# Altium schematic sheet debug_interface.SchDoc: Debug interface
size A4; SheetNumber: 3; SheetTotal: 11
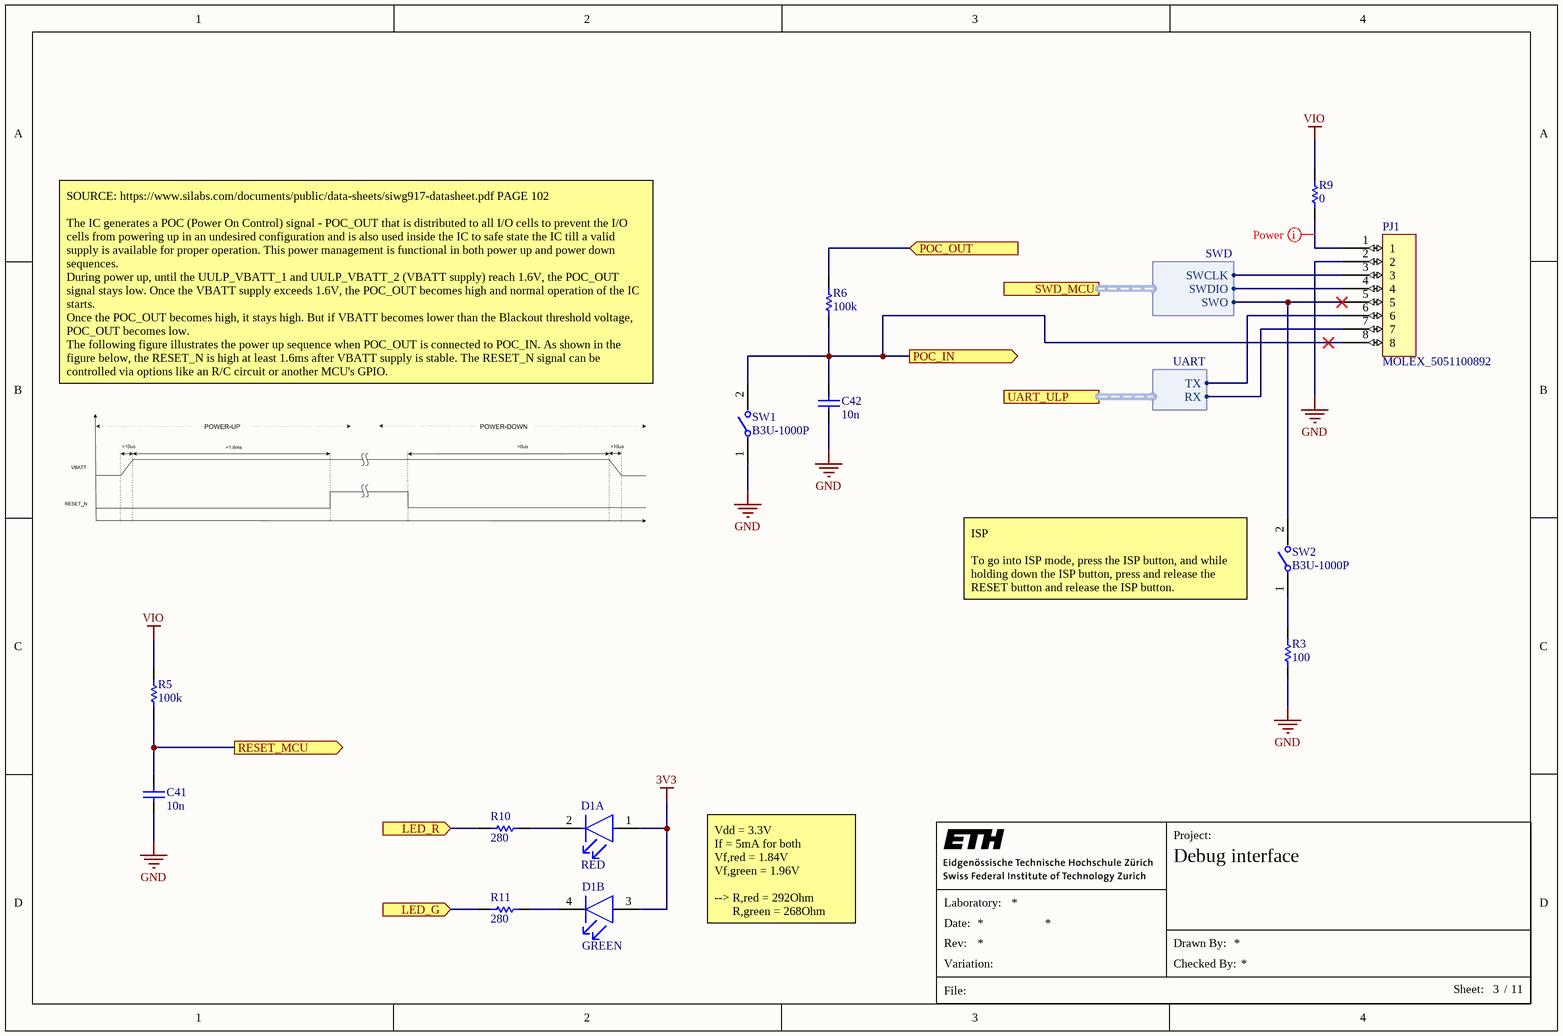
[diagram p0: debug_interface.SchDoc]

## Parts
C41  10n  [CAPC1005X55X25LL05T10]
C42  10n  [CAPC1005X55X25LL05T10]
D1  RED  [FP-APTB1615SURKCGKC-F01-MFG]  (parts A,B of 2)
PJ1  MOLEX_5051100892  [MOLEX_5051100892]
R3  100  [RESC1005X40X25ML05T10]
R5  100k  [RESC1005X40X25NL05T10]
R6  100k  [RESC1005X40X25NL05T10]
R9  value 0  [RESC1005X40X25ML05T10]  (hidden comment: Resistor 0R 0402 63 mW)
R10  280  [RESC1005X40X25NL05T10]
R11  280  [RESC1005X40X25NL05T10]
SW1  B3U-1000P  [FP-B3U-1000P-MFG]
SW2  B3U-1000P  [FP-B3U-1000P-MFG]

## Ports
LED_G (in, see main[3B], io_a[3A], power_io[6B]), LED_R (in, see main[3A], io_a[3A], power_io[6B]), POC_IN (out, see main[3A], power_core[1C], power_io[2B]), POC_OUT (in, see main[3A], power_core[1C], power_io[2B]), RESET_MCU (out, see main[3A], power_core[1C], power_io[2B]), SWD_MCU (harness SWD, see main[3A], io_b[4C], power_io[6C]), UART_ULP (harness UART, see main[3A], io_b[4C], power_io[6C])

## Harnesses
SWD: SWCLK, SWDIO, SWO
UART: RX, TX

## Nets
3V3: D1.1(RED_A) D1.3(GREEN_A)
GND: C41.2 C42.2 PJ1.2 R3.1 SW1.1
VIO: R5.2 R9.2
LED_G: R11.1 ; port LED_G
LED_R: R10.1 ; port LED_R
POC_IN: C42.1 PJ1.8 R6.1 SW1.2 ; port POC_IN
POC_OUT: R6.2 ; port POC_OUT
RESET_MCU: C41.1 R5.1 ; port RESET_MCU
NetD1_2: D1.2(RED_C) R10.2
NetD1_4: D1.4(GREEN_C) R11.2
NetPJ1_1: PJ1.1 R9.1
NetPJ1_3: PJ1.3 ; port SWD_MCU.SWCLK
NetPJ1_4: PJ1.4 ; port SWD_MCU.SWDIO
NetPJ1_5: PJ1.5 SW2.2 ; port SWD_MCU.SWO
NetPJ1_6: PJ1.6 ; port UART_ULP.TX
NetPJ1_7: PJ1.7 ; port UART_ULP.RX
NetR3_2: R3.2 SW2.1

## Layout directives
net class Power: NetPJ1_1

## Notes on the sheet
- SOURCE: https://www.silabs.com/documents/public/data-sheets/siwg917-datasheet.pdf PAGE 102
  The IC generates a POC (Power On Control) signal - POC_OUT that is distributed to all I/O cells to prevent the I/O cells from powering up in an undesired configuration and is also used inside the IC to safe state the IC till a valid supply is available for proper operation. This power management is functional in both power up and power down sequences.
  During power up, until the UULP_VBATT_1 and UULP_VBATT_2 (VBATT supply) reach 1.6V, the POC_OUT signal stays low. Once the VBATT supply exceeds 1.6V, the POC_OUT becomes high and normal operation of the IC starts.
  Once the POC_OUT becomes high, it stays high. But if VBATT becomes lower than the Blackout threshold voltage, POC_OUT becomes low.
  The following figure illustrates the power up sequence when POC_OUT is connected to POC_IN. As shown in the figure below, the RESET_N is high at least 1.6ms after VBATT supply is stable. The RESET_N signal can be controlled via options like an R/C circuit or another MCU's GPIO.
- ISP
  To go into ISP mode, press the ISP button, and while holding down the ISP button, press and release the RESET button and release the ISP button.
- Vdd = 3.3V
  If = 5mA for both
  Vf,red = 1.84V
  Vf,green = 1.96V
  --> R,red = 292Ohm
  R,green = 268Ohm
- Project:
- Laboratory:
- Date:
- File:
- Rev:
- Variation:
- Drawn By:
- Checked By:
- Sheet:
- /

## Library data of the parts
C41 C42 = CMP-1034-01880-2: Manufacturer: Murata; Part Number: GRM155R71E103KA01D
D1 = CMP-44529-000005-1: LED GREEN/RED CLEAR CHIP SMD; Manufacturer: Kingbright; Manufacturer Part Number: APTB1615SURKCGKC-F01; Reverse Voltage: 5V; Viewing Angle: 150°; Max Junction Temp: +115°C; Led Orientation: Top View; Wavelength: 630/570nm; Colour: Red, Green; Forward Voltage: 1.95/2.1V; Peak Emmision Wavelength: 645/574nm; Power Dissipation: 75mW; Forward Current: 20mA; Luminous Intensity: 200/50mcd; Temperature Range High: +85°C; Temperature: -40°C to +85°C; Digikey Description: LED GREEN/RED CLEAR CHIP SMD; RoHS: TRUE; Automotive: No; Octopart: https://octopart.com/aptb1615surkcgkc-f01-kingbright-5355651; Temperature Range Low: -40°C; Device Class L3: unset; ComponentLink2Description: Datasheet; Device Class L1: Optoelectronics; Height: 0.9mm; ComponentLink2URL: http://www.kingbrightusa.com/images/catalog/SPEC/APTB1615SURKCGKC-F01.pdf; Category: Diode; Package: APTB1615SURKCGKC-F01; Device Class L2: LEDs; Lead Free: Yes
R3 = CMP-2002-07344-1: Part Number: RC0402FR-07100RL; Manufacturer: Yageo / Phycomp
R5 R6 = CMP-2002-07343-1: Part Number: RC0402FR-07100KL; Manufacturer: Yageo / Phycomp
R9 = CMP-009-00004-5: Chip Resistor, 0 Ohm, 0.063 W, -55 to 155 degC, 0402 (1005 Metric); Power: 63mW; Voltage Rating: 50V; Max Operating Temperature: 155°C; Pins: 2; RoHS Compliant: True; Min Operating Temperature: -55°C; Mounting Technology: SM; Case/Package: 0402
R10 R11 = CMP-1011-00446-2: Manufacturer: Yageo; Part Number: RC0402FR-07280RL
SW1 SW2 = CMP-2100-03586-2: SWITCH TACTILE SPST-NO 0.05A 12V; Contact Resistance: 100mR; Operating Force: 1.5N; Max Current Rating: 50mA; Switch Travel: 0.15mm; Actuator Type: Standard; Mechanical Life: 200000Cycles; Ratings: Dust Proof; Illumination Type: Non-Illuminated; Throw Configuration: SPST; Actuator Length: 0.4mm; Switch Function: Off-Mom; Height: 1.2mm; Width: 3mm; Weight: 0.000776oz; Contact Material: Silver; Max Voltage Rating (DC): 12V; Insulation Resistance: 100MR; Lead Free: Lead Free; Current Rating: 50mA; Termination: SMD/SMT; Length: 4mm; Voltage Rating (DC): 12V; Contact Current Rating: 50mA; Orientation: Straight; Depth: 2.5mm; Max Operating Temperature: 70°C; Packaging: Tape and Reel; Min Operating Temperature: -25°C; Package Quantity: 1; Mount: Surface Mount; Electrical Life: 200000Cycles